# Altium schematic sheet Blocks_Board.SchDoc
size A4; SheetNumber: 2; SheetTotal: 9
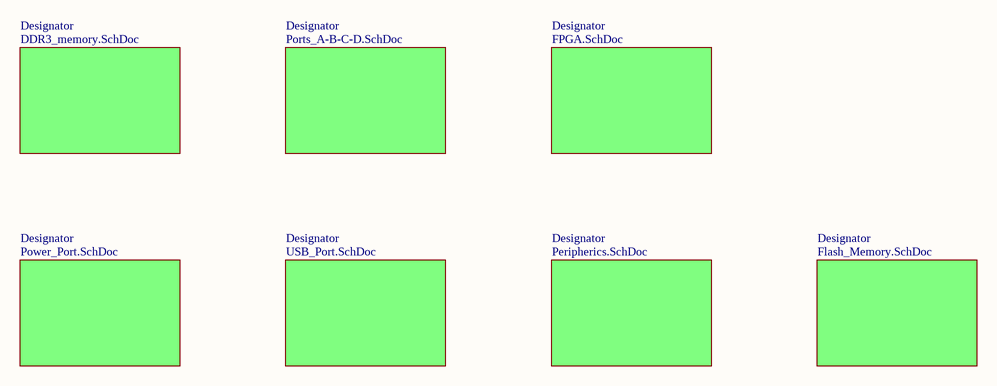
[diagram p0: Blocks_Board.SchDoc]

## Sub-sheets
Designator = DDR3_memory.SchDoc: no entries
Designator = Ports_A-B-C-D.SchDoc: no entries
Designator = FPGA.SchDoc: no entries
Designator = Power_Port.SchDoc: no entries
Designator = USB_Port.SchDoc: no entries
Designator = Peripherics.SchDoc: no entries
Designator = Flash_Memory.SchDoc: no entries